# Altium schematic sheet SupplyBoxTest.SchDoc
size A; SheetNumber: 1; SheetTotal: 1
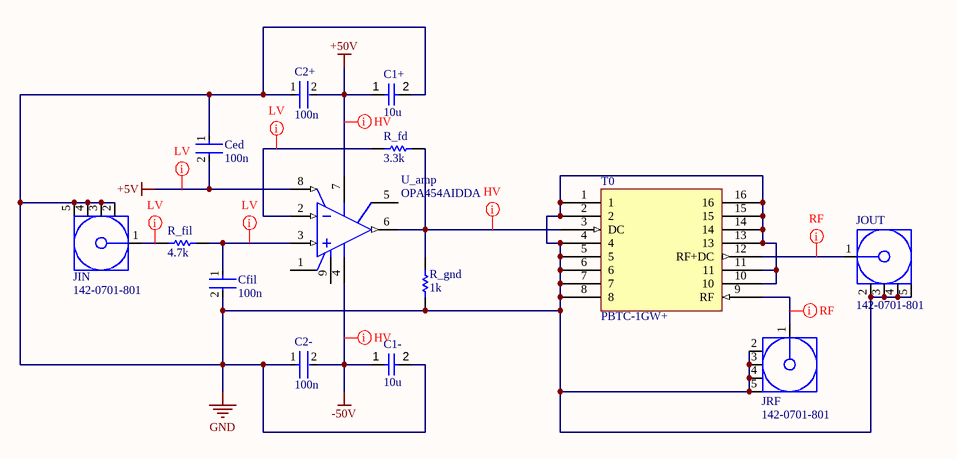
[diagram p0: SupplyBoxTest.SchDoc]

## Parts
C1+  10u  [RAHV1100M1UCC8002E-Footprint-1]
C1-  10u  [RAHV1100M1UCC8002E-Footprint-1]
C2+  100n  [FP-CC0805-0_85-MFG]
C2-  100n  [FP-CC0805-0_85-MFG]
Ced  100n  [FP-CC0805-0_85-MFG]
Cfil  100n  [FP-CC0805-0_85-MFG]
JIN  142-0701-801  [CINC-142-0701-801_V]
JOUT  142-0701-801  [CINC-142-0701-801_V]
JRF  142-0701-801  [CINC-142-0701-801_V]
R_fd  3.3k  [RESC2013X60X35ML10T20]
R_fil  4.7k  [RESC2013X60X35NL10T20]
R_gnd  1k  [RESC2013X60X35ML10T20]
T0  PBTC-1GW+  [PBTC-1GW+]
U_amp  OPA454AIDDA  [DDA0008C_L]

## Nets
+5V: Ced.2 U_amp.8(E/D)
+50V: C1+.1 C2+.2 U_amp.7(V+)
-50V: C1-.1 C2-.2 U_amp.4(V-)
GND: C1+.2 C1-.2 C2+.1 C2-.1 Ced.1 Cfil.2 JIN.2 JIN.3 JIN.4 JIN.5 JOUT.2 JOUT.3 JOUT.4 JOUT.5 JRF.2 JRF.3 JRF.4 JRF.5 R_gnd.1 T0.1 T0.2 T0.4 T0.5 T0.6 T0.7 T0.8 T0.10 T0.11 T0.13 T0.14 T0.15 T0.16
NetCfil_1: Cfil.1 R_fil.2 U_amp.3(IN+)
NetJIN_1: JIN.1 R_fil.1
NetJOUT_1: JOUT.1 T0.12(RF+DC)
NetJRF_1: JRF.1 T0.9(RF)
NetR_fd_1: R_fd.1 U_amp.2(IN-)
NetR_fd_2: R_fd.2 R_gnd.2 T0.3(DC) U_amp.6(OUT)

Not connected (* = marked no-connect by the designer): U_amp 1(E/D_COM) 5(STATUS_FLAG) 9(EP)

## Layout directives
net class HV: +50V, -50V, NetR_fd_2
net class RF: NetJOUT_1, NetJRF_1
net class LV: +5V, NetCfil_1, NetJIN_1, NetR_fd_1

## Library data of the parts
C1+ C1- = CMP-001-00083-1: Aluminum Electrolytic Capacitor, Polarized, Aluminum (solid Polymer), 50V, 20% +Tol, 20% -Tol, 10uF, Surface Mount, 2121; RoHS Compliant: Yes
C2+ C2- = CMP-1036-04410-2: CAP CER 0.1UF 25V X7R 0805; Manufacturer Part Number: CC0805KRX7R8BB104; Manufacturer: Yageo; Tolerance: 0.1; Material: Ceramic; Value: 100 nF; ComponentLink2URL: http://www.yageo.com/documents/recent/UPY-GPHC_Y5V_6.3V-to-50V_8.pdf; Category: Cap; Mouser Description: Multilayer Ceramic Capacitors MLCC - SMD/SMT 100nF 25V X7R 10%; Device Class L1: Passive Components; Footprint Url: http://www.yageo.com/exep/pages/download/literatures/UPY-C_GEN_24.pdf; Height: 0.95mm; Digikey Description: CAP CER 0.1UF 25V X7R 0805; Lead Free: Yes; Temperature Range High: +85°C; Temperature: -30°C to +85°C; Ipc Land Pattern Name: CAPC200125X85; Capacitance: 100 nF; Automotive: No; Octopart: https://octopart.com/cc0805krx7r8bb104-yageo-39467766; Device Class L2: Capacitors; Temperature Characteristic: X7R; Voltage Rating: 25 V; ComponentLink2Description: Datasheet; Temperature Range Low: -30°C; Device Class L3: Ceramic Capacitors; RoHS: TRUE; Package: CC0805-0.85
Ced Cfil = CMP-1036-04410-2: CAP CER 0.1UF 25V X7R 0805; Manufacturer Part Number: CC0805KRX7R8BB104; Manufacturer: Yageo; Tolerance: 0.1; Value: 100 nF; ComponentLink2URL: http://www.yageo.com/documents/recent/UPY-GPHC_Y5V_6.3V-to-50V_8.pdf; Category: Cap; Mouser Description: Multilayer Ceramic Capacitors MLCC - SMD/SMT 100nF 25V X7R 10%; Device Class L1: Passive Components; Footprint Url: http://www.yageo.com/exep/pages/download/literatures/UPY-C_GEN_24.pdf; Height: 0.95mm; Material: Ceramic; Digikey Description: CAP CER 0.1UF 25V X7R 0805; Lead Free: Yes; Temperature Range High: +85°C; Temperature: -30°C to +85°C; Ipc Land Pattern Name: CAPC200125X85; Capacitance: 100 nF; Automotive: No; Octopart: https://octopart.com/cc0805krx7r8bb104-yageo-39467766; Device Class L2: Capacitors; Temperature Characteristic: X7R; Voltage Rating: 25 V; ComponentLink2Description: Datasheet; Temperature Range Low: -30°C; Device Class L3: Ceramic Capacitors; RoHS: TRUE; Package: CC0805-0.85
JIN JOUT JRF = CMP-2000-05490-1: SMA End Launch Jack Receptacle, 50 Ohm, 0 to 18 GHz, -65 to 165 degC, 5-Pin SMD, RoHS, Bulk; Manufacturer: EmersonConnectivitySolutions; Connector Type: JackPCB; Gender: Jack(Female); Impedance: 50Ohms; Brand: Johnson/EmersonConnectivitySolutions; Body Material: Brass; Body Style: Straight; Maximum Frequency: 18GHz; Factory Pack Quantity: 5; Datasheet URL: https://belfuse.com/resources/Johnson/productinformation/pi-142-0701-801.pdf; Datasheet Version: 12/2014; Operating Temperature Range: -65Cto+165C; Mounting Technology: SurfaceMount; RF Series: SMA; Package Reference: 142-0701-801; Product Category: RFConnectors/CoaxialConnectors; Termination Style: Solder; RoHS: Details; Package URL: https://belfuse.com/resources/Johnson/drawings/dr-1420701801.pdf; Series: SMA; Package Description: 5-Pin Surface Mount Device, Body 14.275 x 9.525 mm; Manufacturer URL: http://www.cinch.com/; Contact Plating: Gold; Product: Connectors; Orientation: Straight
R_fd = CMP-1013-00567-2: Chip Resistor, 3.3 KOhm, +/- 1%, 0.125 W, -55 to 155 degC, 0805 (2012 Metric), RoHS, Tape and Reel; Manufacturer: Yageo; Voltage Rating: 150V; Max Power Dissipation: 125mW; Temperature Coefficient: 100ppm/degreesC; Package Quantity: 1; Max Operating Temperature: 155degC; Case Code (Metric): 2012; Package Reference: 0805; Resistance: 3.3KOhm; Composition: ThickFilm; RoHSCompliant: true; Case/Package: 0805; Case Code (Imperial): 0805; Tolerance: 1%; Depth: 1.25mm; Weight: 0.000194oz; Lead Free: LeadFree; Min Operating Temperature: -55degC; Termination: SMD/SMT; Datasheet Version: Rev. 5, 10/2016; REACH SVHC: NoSVHC; Power Rating: 125mW; Packaging: TapeandReel; Number of Terminations: 2; Width: 0.049inch; Package Description: 2-Pin Surface Mounted Device, Body 2 x 1.25 mm; Datasheet URL: http://www.yageo.com/NewPortal/yageodocoutput?fileName=/pdf/R-Chip/PYu-RC_Group_51_RoHS_L_5.pdf; Height: 0.5mm; Length: 2mm; Manufacturer URL: http://www.yageo.com/
R_fil = CMP-1659-00011-4: Chip Resistor, 47 KOhm, +/- 1%, 0.125 W, -55 to 155 degC, 0805 (2012 Metric), RoHS, Tape and Reel; Manufacturer: Yageo; Voltage Rating: 150 V; Height: 0.5 mm; ComponentLink2URL: http://www.yageo.com/documents/recent/PYu-RC_Group_51_RoHS_L_04.pdf; ComponentLink2Description: Datasheet; Package Quantity: 200; Max Operating Temperature: 155 degC; Min Operating Temperature: -55 degC; Packaging: Tape and Reel; Pins: 2; PackageReference: 0805; Mounting Technology: Surface Mount; ComponentLink1Description: Manufacturer URL; ComponentLink1URL: http://www.yageo.com/; PackageDescription: 2-Pin Surface Mounted Device, Body 2 x 1.25 mm; Length: 2 mm; REACH SVHC: No SVHC; Mount: Surface Mount; RoHSCompliant: true; DatasheetVersion: Rev. 4, 02/2016
R_gnd = CMP-2100-03671-1: Chip Resistor, 1 KOhm, +/- 1%, 125 mW, -55 to 155 degC, 0805 (2012 Metric), RoHS, Tape and Reel; Manufacturer: Yageo; Temperature Coefficient: 100ppm/degreesC; Voltage Rating (DC): 150V; Max Power Dissipation: 125mW; Resistance: 1KOhm; Number of Pins: 2; Number of Terminations: 2; Datasheet URL: http://www.yageo.com/NewPortal/yageodocoutput?fileName=/pdf/R-Chip/PYu-RC_Group_51_RoHS_L_5.pdf; Length: 0.079inch; Package Description: 2-Pin Surface Mounted Device, Body 2 x 1.25 mm; Depth: 1.25mm; Height: 0.024inch; Military Standard: Not; Case/Package: 0805; Package Reference: 0805; RoHSCompliant: true; Lead Free: LeadFree; Packaging: TapeandReel; Package Quantity: 1; Datasheet Version: Rev. 5, 10/2016; Tolerance: 1%; Min Operating Temperature: -55degC; Voltage Rating: 150V; Composition: ThickFilm; Case Code (Imperial): 0805; Power Rating: 125mW; Width: 0.049inch; Case Code (Metric): 2012; Manufacturer URL: http://www.yageo.com/; Max Operating Temperature: 155degC; REACH SVHC: Unknown; Termination: SMD/SMT
T0 = CMP-00025-00003-1: Monitor TEE DC Block, 0.1MHz Min, 1000MHz Max, 1dB Insertion Loss-Max; Min Operating Temperature: -55°C; Max Operating Temperature: 100°C; RoHS Compliant: Yes
U_amp = CMP-0017-00714-2: High Voltage (100V), High-Current (50mA) Operational Amplifier, G=1 Stable, 10 to 100 V, -55 to 125 degC, 8-pin SOP (DDA8), Green (RoHS & no Sb/Br); Manufacturer: Texas Instruments; Number of Channels: 1; CMRR(Min)(dB): 100; Rating: Catalog; Total Supply Voltage(Min)(+5V is 5, +/-5V is 10): 10; Offset Drift(Typ)(uV/C): 1.6; Vn at 1kHz(Typ)(nV/rtHz): 47; Slew Rate(Typ)(V/us): 13; Sub Family: General Purpose Amplifier, High Output Current Amplifier (>=50mA), High Supply Voltage Amplifier (>=30V), Precision Amplifier; Iq per channel(Max)(mA): 4; GBW(Typ)(MHz): 2.5; Code_JEDEC: MS-012; ComponentLink3URL: http://www.ti.com/litv/pdf/mpds092e; ComponentLink1Description: Manufacturer URL; PackageDescription: 8-Pin PowerPAD(TM) Plastic Small Outline, Body 3.9 x 4.9 mm, Pitch 1.27 mm; PackageVersion: 4202561/F, 12/2011; ComponentLink3Description: Package Specification; ComponentLink2URL: http://www.ti.com/lit/ds/symlink/opa454.pdf; ComponentLink2Description: Datasheet; IIB(Max)(pA): 100; ComponentLink1URL: http://www.ti.com/; DatasheetVersion: SBOS391A; Total Supply Voltage(Max)(+5V is 5, +/-5V is 10): 100; Eco-Plan: Green (RoHS & no Sb/Br); Mounting Technology: Surface Mount; Vio (25C)(Max)(mV): 4; PackageReference: DDA0008C; PartNumber: OPA454AIDDA